# Altium schematic sheet Microphone-Boards_V1.0.SchDoc: Microphone-Boards
size A4; PageSetup: Record=PageOptions|CenterHorizontal=True|CenterVertical=True|PrintScale=0.97|XCorrection=1.00|YCorrection=1.00|PrintKind=0|BorderSize=5000000|LeftOffset=0|BottomOffset=0|Orientation=2|PaperLength=1000|PaperWidth=1000|Scale=100|PaperSource=7|PrintQuality=-3|MediaType=1|DitherType=10|PrintScaleMode=1|PaperKind=A4|PaperIndex=9; Organization: Ostschweizer Fachhochschule; Address2: Florian Baumgartner & Alain Keller; Address3: florian.baumgartner@ost.ch; DocumentNumber: 1; Revision: V1.0; SheetNumber: 1; SheetTotal: 5; Author: Florian Baumgartner & Alain Keller; Subtitle: Overview
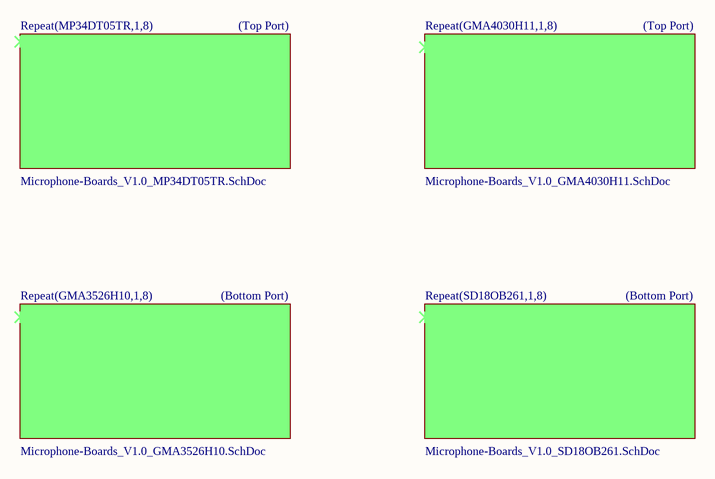
[diagram p0: Microphone-Boards_V1.0.SchDoc]

## Sub-sheets
Repeat(GMA3526H10,1,8) = Microphone-Boards_V1.0_GMA3526H10.SchDoc: REPEAT(M)
Repeat(GMA4030H11,1,8) = Microphone-Boards_V1.0_GMA4030H11.SchDoc: REPEAT(M)
Repeat(MP34DT05TR,1,8) = Microphone-Boards_V1.0_MP34DT05TR.SchDoc: REPEAT(M)
Repeat(SD18OB261,1,8) = Microphone-Boards_V1.0_SD18OB261.SchDoc: REPEAT(M)

## Notes on the sheet
- (Top Port)
- (Bottom Port)
- Title
- Author:
- Subtitle
- Date:
- Rev:
- File:
- Sheet
- of